# Altium schematic sheet Coffee_printer MCU.SchDoc
size 420 x 297 mm; SheetNumber: 1; SheetTotal: 5; ProjectTitle: Prj name
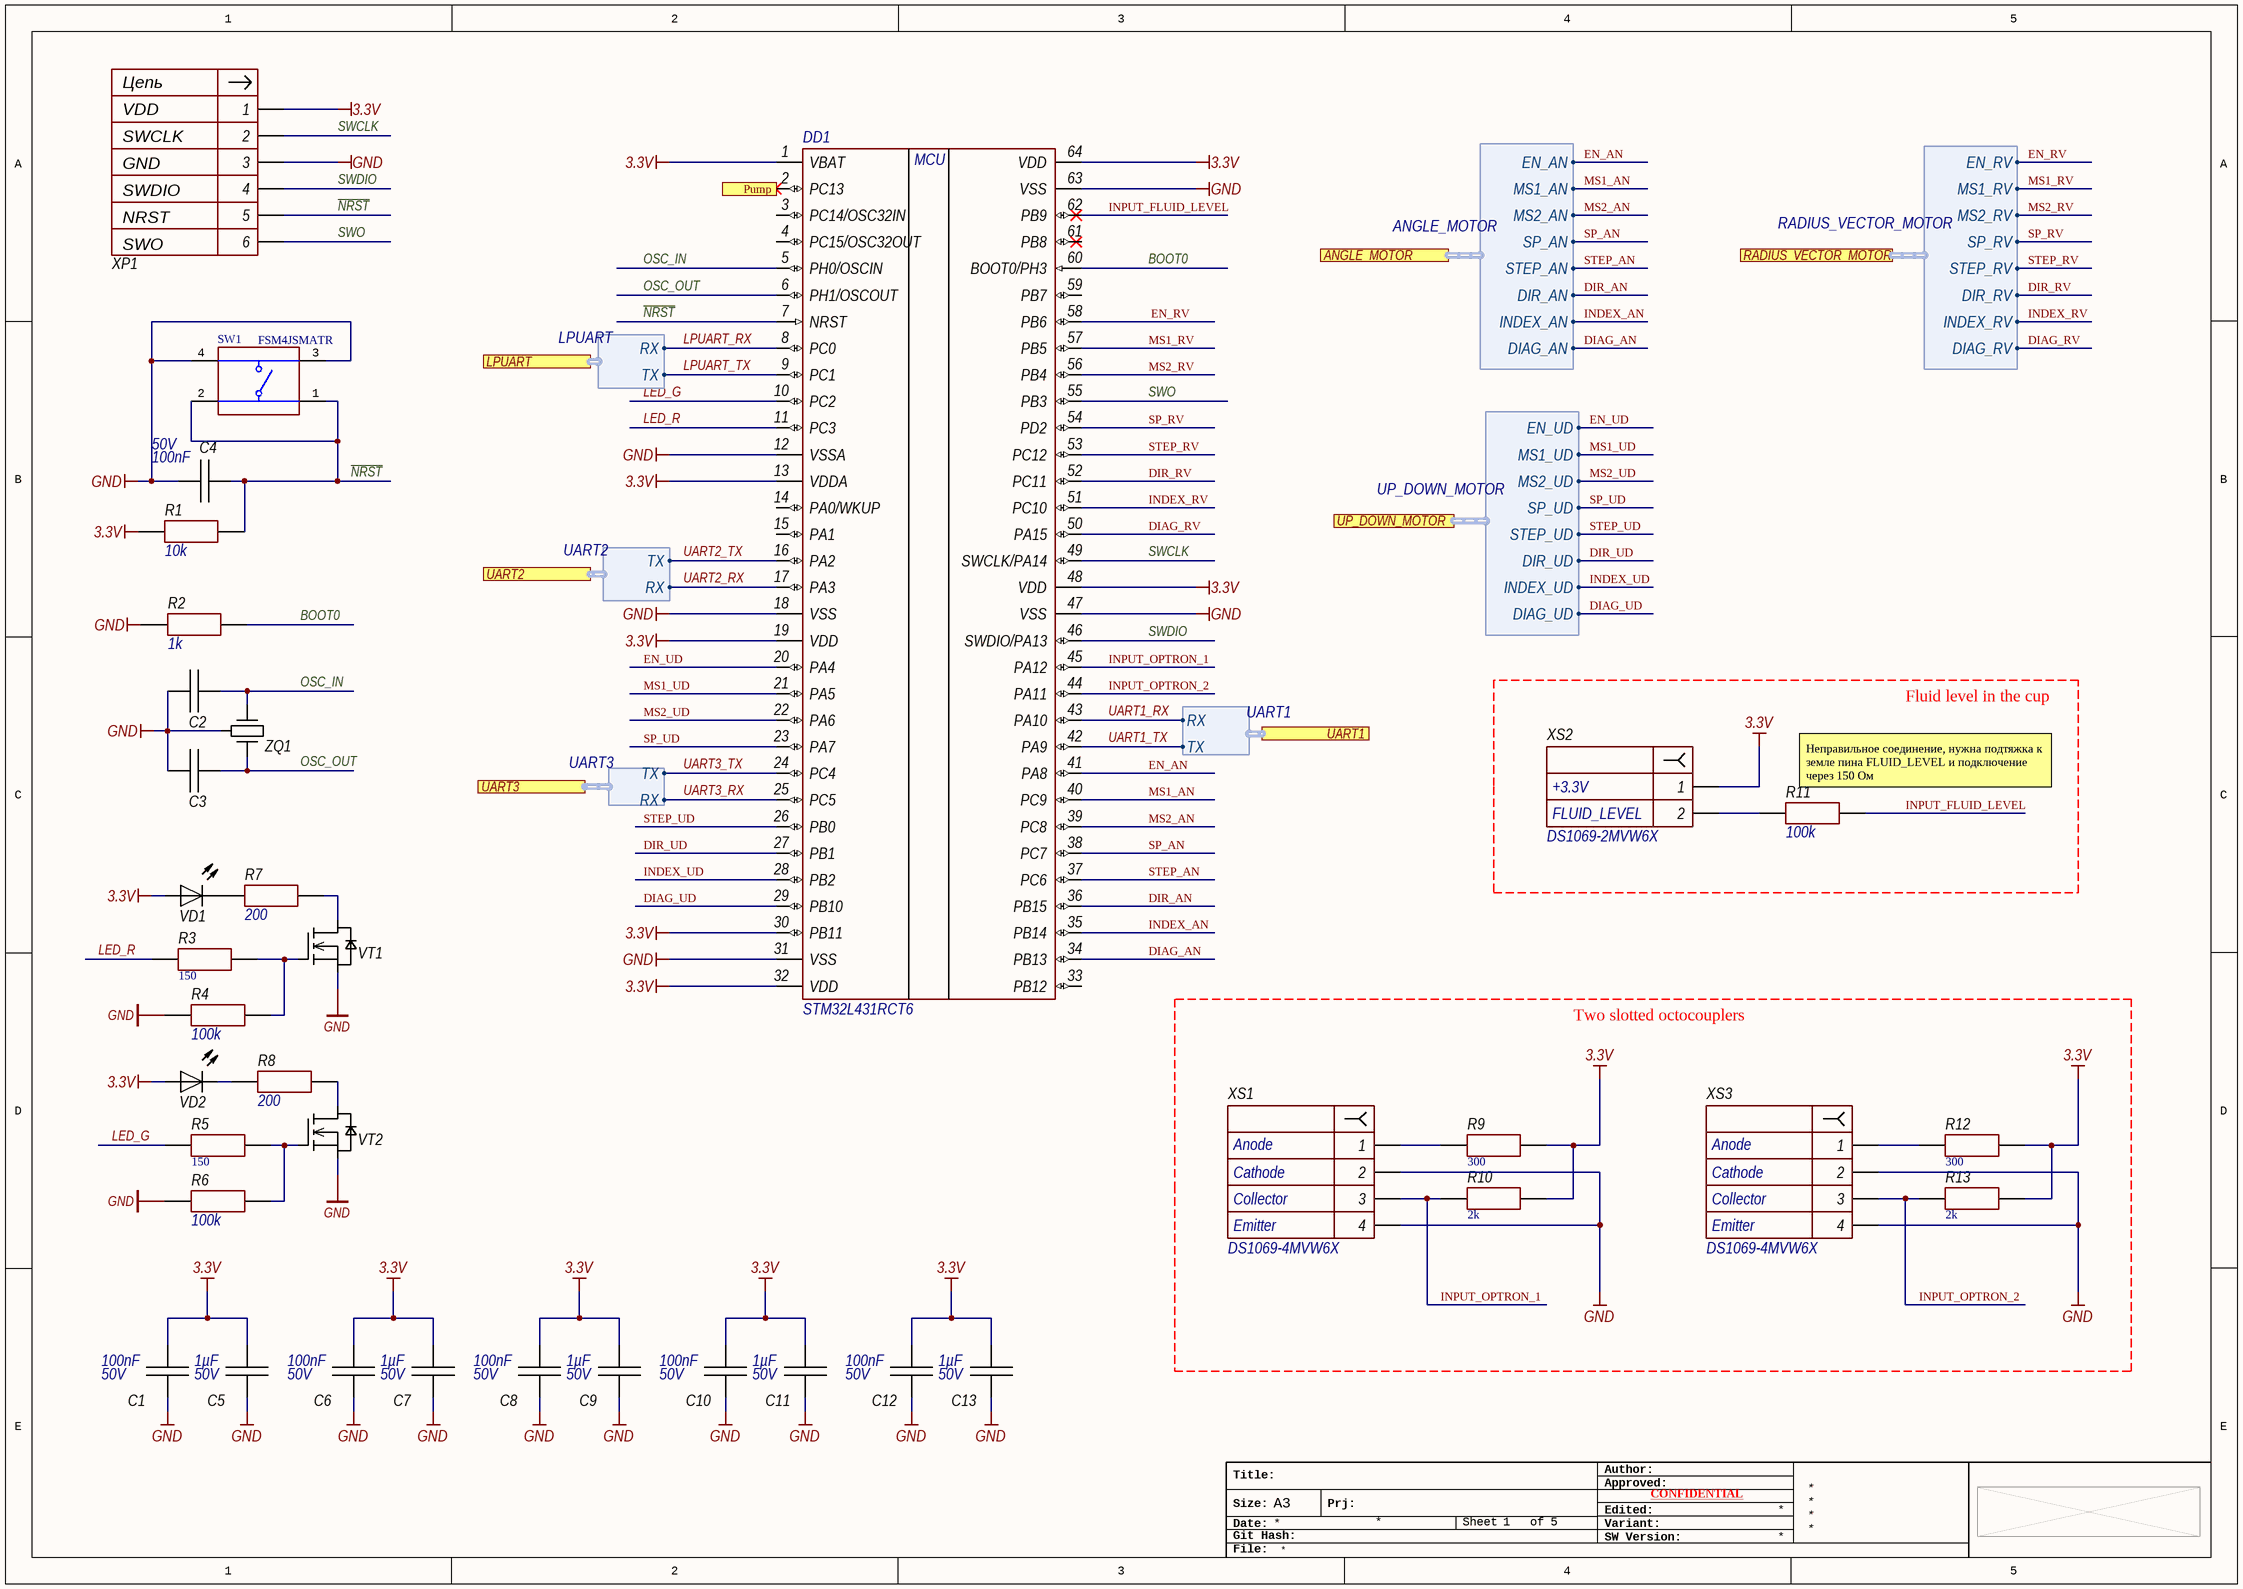
[diagram p0: Coffee_printer MCU.SchDoc]

## Parts
C1  Capacitance: 100nF  Voltage Rating: 50V  [CAPC0603_H0.90_N]  (hidden comment: CC0603KRX7R7BB104)
C2  18  [CAPC0603_H0.85_N]  (value not drawn)
C3  18  [CAPC0603_H0.85_N]  (value not drawn)
C4  Capacitance: 100nF  Voltage Rating: 50V  [CAPC0603_H0.90_N]  (hidden comment: CC0603KRX7R7BB104)
C5  Voltage Rating: 50V  Capacitance: 1µF  [CAPC0603_H0.90_N]  (hidden comment: CC0603KRX7R7BB105)
C6  Capacitance: 100nF  Voltage Rating: 50V  [CAPC0603_H0.90_N]  (hidden comment: CC0603KRX7R7BB104)
C7  Voltage Rating: 50V  Capacitance: 1µF  [CAPC0603_H0.90_N]  (hidden comment: CC0603KRX7R7BB105)
C8  Capacitance: 100nF  Voltage Rating: 50V  [CAPC0603_H0.90_N]  (hidden comment: CC0603KRX7R7BB104)
C9  Voltage Rating: 50V  Capacitance: 1µF  [CAPC0603_H0.90_N]  (hidden comment: CC0603KRX7R7BB105)
C10  Capacitance: 100nF  Voltage Rating: 50V  [CAPC0603_H0.90_N]  (hidden comment: CC0603KRX7R7BB104)
C11  Voltage Rating: 50V  Capacitance: 1µF  [CAPC0603_H0.90_N]  (hidden comment: CC0603KRX7R7BB105)
C12  Capacitance: 100nF  Voltage Rating: 50V  [CAPC0603_H0.90_N]  (hidden comment: CC0603KRX7R7BB104)
C13  Voltage Rating: 50V  Capacitance: 1µF  [CAPC0603_H0.90_N]  (hidden comment: CC0603KRX7R7BB105)
DD1  STM32L431RCT6  [LQFP-64]
R1  Resistance: 10k  [RESC0603_N]  (hidden comment: RC0603FR-0710KL)
R2  Resistance: 1k  [RESC0603_N]  (hidden comment: RC0603FR-071KL)
R3  Resistance: 150  [RESC0603_N]  (hidden comment: RC0603FR-07150RL)
R4  Resistance: 100k  [RESC0603_N]  (hidden comment: RC0603FR-07100KL)
R5  Resistance: 150  [RESC0603_N]  (hidden comment: RC0603FR-07150RL)
R6  Resistance: 100k  [RESC0603_N]  (hidden comment: RC0603FR-07100KL)
R7  Resistance: 200  [RESC0603_N]  (hidden comment: RC0603FR-07200RL)
R8  Resistance: 200  [RESC0603_N]  (hidden comment: RC0603FR-07200RL)
R9  Resistance: 300  [RESC0603_N]  (hidden comment: RC0603FR-07300RL)
R10  Resistance: 2k  [RESC0603_N]  (hidden comment: RC0603FR-072KL)
R11  Resistance: 100k  [RESC0603_N]  (hidden comment: RC0603FR-07100KL)
R12  Resistance: 300  [RESC0603_N]  (hidden comment: RC0603FR-07300RL)
R13  Resistance: 2k  [RESC0603_N]  (hidden comment: RC0603FR-072KL)
SW1  FSM4JSMATR  [TECO-FSM4JSMATR_V]
VD1  FYLS-0603URC  [CH0603LR]  (value not drawn)
VD2  FYLS-0603UGC  [CH0603LG]  (value not drawn)
VT1  MMBF170LT1G  [SOT-23-3]  (value not drawn)
VT2  MMBF170LT1G  [SOT-23-3]  (value not drawn)
XP1  STM32_6pin_SWD  [PLS-6(DS-1021-1x6)]  (value not drawn)
XS1  DS1069-4MVW6X  NET4: Emitter  NET3: Collector  NET2: Cathode  NET1: Anode  [CWF-4]
XS2  DS1069-2MVW6X  NET2: FLUID_LEVEL  NET1: +3.3V  [CWF-2]
XS3  DS1069-4MVW6X  NET4: Emitter  NET3: Collector  NET2: Cathode  NET1: Anode  [CWF-4]
ZQ1  ABM3B-8.000MHZ-B2-T  [ZQ_ABM3B-B2-T]  (value not drawn)

## Blocks framed on the sheet
Fluid level in the cup: R11 XS2
Two slotted octocouplers: R9 R10 R12 R13 XS1 XS3

## Ports
ANGLE_MOTOR (harness ANGLE_MOTOR), LPUART (harness LPUART), Pump (in), RADIUS_VECTOR_MOTOR (harness RADIUS_VECTOR_MOTOR), UART1 (harness UART1), UART2 (harness UART2), UART3 (harness UART3), UP_DOWN_MOTOR (harness UP_DOWN_MOTOR)

## Harnesses
UART2: RX, TX
UART1: RX, TX
UART3: RX, TX
LPUART: TX, RX
ANGLE_MOTOR: MS1_AN, EN_AN, MS2_AN, SP_AN, STEP_AN, DIR_AN, INDEX_AN, DIAG_AN
RADIUS_VECTOR_MOTOR: MS1_RV, EN_RV, MS2_RV, SP_RV, STEP_RV, DIR_RV, INDEX_RV, DIAG_RV
UP_DOWN_MOTOR: MS1_UD, EN_UD, MS2_UD, SP_UD, STEP_UD, DIR_UD, INDEX_UD, DIAG_UD

## Nets
3.3V: C1.1 C5.1 C6.1 C7.1 C8.1 C9.1 C10.1 C11.1 C12.1 C13.1 DD1.1(VBAT) DD1.13(VDDA) DD1.19(VDD) DD1.30(PB11) DD1.32(VDD) DD1.48(VDD) DD1.64(VDD) R1.1 R9.2 R10.2 R12.2 R13.2 VD1.1 VD2.1 XP1.1 XS2.1
GND: C1.2 C2.1 C3.1 C4.1 C5.2 C6.2 C7.2 C8.2 C9.2 C10.2 C11.2 C12.2 C13.2 DD1.12(VSSA) DD1.18(VSS) DD1.31(VSS) DD1.47(VSS) DD1.63(VSS) R2.1 R4.1 R6.2 SW1.3 SW1.4 VT1.2(S) VT2.2(S) XP1.3 XS1.2 XS1.4 XS3.2 XS3.4 ZQ1.2
BOOT0: DD1.60(BOOT0/PH3) R2.2
DIAG_AN: DD1.34(PB13) ; port ANGLE_MOTOR.DIAG_AN
DIAG_RV: DD1.50(PA15) ; port RADIUS_VECTOR_MOTOR.DIAG_RV
DIAG_UD: DD1.29(PB10) ; port UP_DOWN_MOTOR.DIAG_UD
DIR_AN: DD1.36(PB15) ; port ANGLE_MOTOR.DIR_AN
DIR_RV: DD1.52(PC11) ; port RADIUS_VECTOR_MOTOR.DIR_RV
DIR_UD: DD1.27(PB1) ; port UP_DOWN_MOTOR.DIR_UD
EN_AN: DD1.41(PA8) ; port ANGLE_MOTOR.EN_AN
EN_RV: DD1.58(PB6) ; port RADIUS_VECTOR_MOTOR.EN_RV
EN_UD: DD1.20(PA4) ; port UP_DOWN_MOTOR.EN_UD
INDEX_AN: DD1.35(PB14) ; port ANGLE_MOTOR.INDEX_AN
INDEX_RV: DD1.51(PC10) ; port RADIUS_VECTOR_MOTOR.INDEX_RV
INDEX_UD: DD1.28(PB2) ; port UP_DOWN_MOTOR.INDEX_UD
INPUT_FLUID_LEVEL: DD1.62(PB9) R11.1
INPUT_OPTRON_1: DD1.45(PA12) R10.1 XS1.3
INPUT_OPTRON_2: DD1.44(PA11) R13.1 XS3.3
LED_G: DD1.10(PC2) R5.1
LED_R: DD1.11(PC3) R3.1
LPUART_RX: DD1.8(PC0) ; port LPUART.RX
LPUART_TX: DD1.9(PC1) ; port LPUART.TX
MS1_AN: DD1.40(PC9) ; port ANGLE_MOTOR.MS1_AN
MS1_RV: DD1.57(PB5) ; port RADIUS_VECTOR_MOTOR.MS1_RV
MS1_UD: DD1.21(PA5) ; port UP_DOWN_MOTOR.MS1_UD
MS2_AN: DD1.39(PC8) ; port ANGLE_MOTOR.MS2_AN
MS2_RV: DD1.56(PB4) ; port RADIUS_VECTOR_MOTOR.MS2_RV
MS2_UD: DD1.22(PA6) ; port UP_DOWN_MOTOR.MS2_UD
~{NRST}: C4.2 DD1.7(NRST) R1.2 SW1.1 SW1.2 XP1.5
OSC_IN: C2.2 DD1.5(PH0/OSCIN) ZQ1.1
OSC_OUT: C3.2 DD1.6(PH1/OSCOUT) ZQ1.3
Pump: DD1.2(PC13) ; port Pump
SP_AN: DD1.38(PC7) ; port ANGLE_MOTOR.SP_AN
SP_RV: DD1.54(PD2) ; port RADIUS_VECTOR_MOTOR.SP_RV
SP_UD: DD1.23(PA7) ; port UP_DOWN_MOTOR.SP_UD
STEP_AN: DD1.37(PC6) ; port ANGLE_MOTOR.STEP_AN
STEP_RV: DD1.53(PC12) ; port RADIUS_VECTOR_MOTOR.STEP_RV
STEP_UD: DD1.26(PB0) ; port UP_DOWN_MOTOR.STEP_UD
SWCLK: DD1.49(SWCLK/PA14) XP1.2
SWDIO: DD1.46(SWDIO/PA13) XP1.4
SWO: DD1.55(PB3) XP1.6
UART1_RX: DD1.43(PA10) ; port UART1.RX
UART1_TX: DD1.42(PA9) ; port UART1.TX
UART2_RX: DD1.17(PA3) ; port UART2.RX
UART2_TX: DD1.16(PA2) ; port UART2.TX
UART3_RX: DD1.25(PC5) ; port UART3.RX
UART3_TX: DD1.24(PC4) ; port UART3.TX
NetR3_2: R3.2 R4.2 VT1.1(G)
NetR5_2: R5.2 R6.1 VT2.1(G)
NetR7_1: R7.1 VD1.2
NetR7_2: R7.2 VT1.3(D)
NetR8_1: R8.1 VD2.2
NetR8_2: R8.2 VT2.3(D)
NetR9_1: R9.1 XS1.1
NetR11_2: R11.2 XS2.2
NetR12_1: R12.1 XS3.1

Not connected (* = marked no-connect by the designer): DD1 3(PC14/OSC32IN) 4(PC15/OSC32OUT) 14(PA0/WKUP) 15(PA1) 33(PB12) 59(PB7) 61(PB8)

## Notes on the sheet
- (near R11) Неправильное соединение, нужна подтяжка к земле пина FLUID_LEVEL и подключение через 150 Ом
- Title:
- Author:
- Approved:
- Size:
- Date:
- Git Hash:
- A3
- Prj:
- Sheet
- of
- SW Version:
- Variant:
- Edited:
- CONFIDENTIAL
- File:
- (in symbol CMP-CON-B2B-0103-4) Цепь; VDD; SWCLK; GND; SWDIO; NRST; SWO
- (in symbol CMP-IC-EMBEDDED-MCU-0000-3) MCU

## Library data of the parts
C1 C4 C6 C8 C10 C12 = CMP-CAP-CER-SMD-0036-1: 0.1uF 10% X7R 50V 0603; Manufacturer: Yageo; Length: 1.6mm; Min Operating Temperature: -55°C; Case Code (Metric): 1608; Case Code (Imperial): 0603; Author: v.ivanchenko; Tolerance: 10%; Case/Package: 0603; Depth: 800µm; Manufacturer Part Number: CC0603KRX7R7BB104; HelpURL: https://www.yageo.com/upload/media/product/products/datasheet/mlcc/UPY-GPHC_X7R_6.3V-to-50V_20.pdf; Max Operating Temperature: 125°C; Lead Free: Lead Free; Height: 800µm; Dielectric: X7R; Series: CC
C2 C3 = CC0603FRNPO9BN180_Yageo: CAPC 18PF 50V C0G/NPO SMD 0603; Manufacturer: Yageo; Tolerance: ± 5 %; Voltage: 50 В; TKE: C0G; ValueBOM: Конденсатор CC0603FRNPO9BN180 "Yageo" (18 пФ ± 5 %, 50 В, C0G, SMD 0603); Автор: Жегалов Сергей; Количество1: 1; Цена1: 0.0348; Количество2: 4000; Цена2: 0.0268; Разрешен к применению: True; Type_BOM: Конденсатор; PartNumber: CC0603FRNPO9BN180_Yageo; HelpURL: http://www.yageo.com/documents/recent/UPY-GP_NP0_16V-to-50V_16.pdf; ManufacturerPartNumber: CC0603FRNPO9BN180; ComponentLink3Description: Datasheet; Value: 18; ComponentLink2Description: Manufacturer Link; ComponentLink2URL: http://www.yageo.com/; Operating Temperature: -55°C ~ +125°C; Modify: 15.11.2018 9:22:46; Supplier: Compel; Supplier P/N: CC0603FRNPO9BN180; Sorting: 18; Package Description: SMD 0603 H0.85mm; ComponentLink4URL: https://sds.compel.ru/search?q=CC0603FRNPO9BN180; ComponentLink5URL: https://www.chipdip.by/search?searchtext=CC0603FRNPO9BN180; ComponentLink6URL: https://belchip.by/search_fuzzy/?query=CC0603FRNPO9BN180; ComponentLink4Description: Compel; ComponentLink5Description: Chip-Dip; ComponentLink6Description: Belchip; Package: CAPC0603; Package_BOM: SMD 0603
C5 C7 C9 C11 C13 = CMP-CAP-CER-SMD-0035-1: 1uF 10% X7R 50V 0603; Manufacturer: Yageo; HelpURL: https://www.yageo.com/upload/media/product/products/datasheet/mlcc/UPY-GPHC_X7R_6.3V-to-50V_20.pdf; Series: CC; Min Operating Temperature: -55°C; Tolerance: 10%; Case Code (Imperial): 0603; Manufacturer Part Number: CC0603KRX7R7BB105; Max Operating Temperature: 125°C; Case/Package: 0603; Depth: 800µm; Length: 1.6mm; Height: 800µm; Case Code (Metric): 1608; Lead Free: Lead Free; Dielectric: X7R; Author: v.ivanchenko
DD1 = CMP-IC-EMBEDDED-MCU-0000-3: MCU 32-Bit STM32 ARM Cortex M4 RISC 256KB Flash 1.8V/2.5V/3.3V 64-Pin LQFP; Manufacturer: ST; Core Architecture: ARM Cortex-M4; Number of Timers/Counters: 1; Number of ADC Channels: 16; Number of D/A Converters: 2; RAM Size: 64; Frequency: 80MHz; Min Supply Voltage: 1.62V; Number of UART Channels: 4; Interface: CAN, I2C, IrDA, LIN, SPI, USART; Max Supply Voltage: 3.6V; Number of USART Channels: 3; Number of PWM Channels: 11; Number of I/Os: 52; Manufacturer Part Number: STM32L431RCT6; Author: a.antipov; Case/Package: LQFP-64; Min Operating Temperature: -40°C; Number of A/D Converters: 1; Number of Pins: 64; Mount: Surface mount; Max Operating Temperature: 85°C; HelpUrl: https://www.st.com/resource/en/datasheet/stm32l431rc.pdf; Number of I2C Channels: 3; Number of SPI Channels: 3; Flash Memory Size: 256kB
R1 = CMP-RES-SMD-0437-2: RES SMD 10 KOHM 1% 1/10W 0603; Manufacturer: Yageo; Max Power Dissipation: 100mW; Temperature Coefficient: ±100ppm/C°; Voltage Rating: 75V; Author: M.S. Koval; Case/Package: 0603; HelpURL: https://www.yageo.com/upload/media/product/productsearch/datasheet/rchip/PYu-RC_Group_51_RoHS_L_11.pdf; Manufacturer Part Number: RC0603FR-0710KL; Max Operating Temperature: 155°C; Min Operating Temperature: -55°C; Tolerance: 1%
R2 = CMP-RES-SMD-0413-2: RES SMD 1 KOHM 1% 1/10W 0603; Manufacturer: Yageo; Max Power Dissipation: 100mW; Temperature Coefficient: ±100ppm/C°; Voltage Rating: 75V; Author: M.S. Koval; Case/Package: 0603; HelpURL: https://www.yageo.com/upload/media/product/productsearch/datasheet/rchip/PYu-RC_Group_51_RoHS_L_11.pdf; Manufacturer Part Number: RC0603FR-071KL; Max Operating Temperature: 155°C; Min Operating Temperature: -55°C; Tolerance: 1%
R3 R5 = CMP-RES-SMD-0393-5: RES SMD 150 OHM 1% 1/10W 0603; Manufacturer: Yageo; Max Power Dissipation: 100mW; Temperature Coefficient: ±100ppm/C°; Voltage Rating: 75V; Author: M.S. Koval; Case/Package: 0603; HelpURL: https://www.yageo.com/upload/media/product/productsearch/datasheet/rchip/PYu-RC_Group_51_RoHS_L_11.pdf; Manufacturer Part Number: RC0603FR-07150RL; Max Operating Temperature: 155°C; Min Operating Temperature: -55°C; Tolerance: 1%
R4 R6 R11 = CMP-RES-SMD-0462-2: RES SMD 100 KOHM 1% 1/10W 0603; Manufacturer: Yageo; Max Power Dissipation: 100mW; Temperature Coefficient: ±100ppm/C°; Voltage Rating: 75V; Author: M.S. Koval; Case/Package: 0603; HelpURL: https://www.yageo.com/upload/media/product/productsearch/datasheet/rchip/PYu-RC_Group_51_RoHS_L_11.pdf; Manufacturer Part Number: RC0603FR-07100KL; Max Operating Temperature: 155°C; Min Operating Temperature: -55°C; Tolerance: 1%
R7 R8 = CMP-RES-SMD-0396-2: RES SMD 200 OHM 1% 1/10W 0603; Manufacturer: Yageo; Max Power Dissipation: 100mW; Temperature Coefficient: ±100ppm/C°; Voltage Rating: 75V; Author: M.S. Koval; Case/Package: 0603; HelpURL: https://www.yageo.com/upload/media/product/productsearch/datasheet/rchip/PYu-RC_Group_51_RoHS_L_11.pdf; Manufacturer Part Number: RC0603FR-07200RL; Max Operating Temperature: 155°C; Min Operating Temperature: -55°C; Tolerance: 1%
R9 R12 = CMP-RES-SMD-0400-5: RES SMD 300 OHM 1% 1/10W 0603; Manufacturer: Yageo; Voltage Rating: 75V; Temperature Coefficient: ±100ppm/C°; Max Power Dissipation: 100mW; Max Operating Temperature: 155°C; Tolerance: 1%; HelpURL: https://www.yageo.com/upload/media/product/productsearch/datasheet/rchip/PYu-RC_Group_51_RoHS_L_11.pdf; Min Operating Temperature: -55°C; Case/Package: 0603; Author: M.S. Koval; Manufacturer Part Number: RC0603FR-07300RL
R10 R13 = CMP-RES-SMD-0420-5: RES SMD 2 KOHM 1% 1/10W 0603; Manufacturer: Yageo; Max Power Dissipation: 100mW; Temperature Coefficient: ±100ppm/C°; Voltage Rating: 75V; Author: M.S. Koval; Case/Package: 0603; HelpURL: https://www.yageo.com/upload/media/product/productsearch/datasheet/rchip/PYu-RC_Group_51_RoHS_L_11.pdf; Manufacturer Part Number: RC0603FR-072KL; Max Operating Temperature: 155°C; Min Operating Temperature: -55°C; Tolerance: 1%
SW1 = CMP-2000-07486-1: Micro Miniature Push Button Switch FSM JSM, 50 mA, -35 to 85 degC, 4-Pin SMD, RoHS, Tape and Reel; Manufacturer: TE Connectivity; Mechanical Life: 100000Cycles; Current Rating: 50mA; Actuator Material: Polyamide; Max Voltage Rating (DC): 12V; Capacitance: 0f; Illumination Type: Illuminated; Voltage Rating (DC): 24V; Case\/Package: SMD/SMT; Operating Force: 160gf; Contact Resistance: 100mOhm; Actuator Length: 0.055inch; Switch Travel: 0.25mm; Throw Configuration: SPST; Termination: GullWing; Contact Plating: Silver; Orientation: Straight; Mounting Technology: SurfaceMount; REACH SVHC: Unknown; Electrical Life: 100000Cycles; Package Reference: FSM4JSMATR; Max Operating Temperature: 85degC; Manufacturer URL: http://www.te.com/; Package Description: 4-Pin Surface Mount Device, Body 6 x 6 mm, Pitch 4.5 mm; Datasheet Version: Rev. V, 02/2015; Packaging: TapeandReel; Min Operating Temperature: -35degC; Mount: SurfaceMount; Contact Current Rating: 50mA; Contact Material: CopperAlloy; Package Quantity: 1200; Datasheet URL: http://www.te.com/commerce/DocumentDelivery/DDEController?Action=showdoc&DocId=Customer+Drawing%7F2-1437565-7%7FV%7Fpdf%7FEnglish%7FENG_CD_2-1437565-7_V.pdf%7F4-1437565-2; RoHSCompliant: true
VD1 = FYLS-0603URC_Foryard Optoelectronics: VD FYLS-0603URC LED RED 20mA 2,1V SMD 0603; ValueBOM: Диод FYLS-0603URC "Foryard Optoelectronics" CH0603; Voltage: 2,1 В; Автор: Коваль Максим; Количество1: 1; Цена1: 0.0450; Количество2: 16000; Цена2: 0.0306; Разрешен к применению: True; ВП: Диод FYLS-0603URC CH0603; Package_BOM: CH0603; Type_BOM: Диод; PartNumber: FYLS-0603URC_Foryard Optoelectronics; HelpURL: http://www.foryard-led.ru/pdf/fyls-0603urc.pdf; ManufacturerPartNumber: FYLS-0603URC; Manufacturer: Foryard Optoelectronics; ComponentLink3Description: Datasheet; Value: FYLS-0603URC; ComponentLink2Description: Manufacturer Link; ComponentLink2URL: http://foryard.com; Operating Temperature: -40°C ~ +85°C; Modify: 14.01.2019 13:57:40; Supplier: Compel; Supplier P/N: FYLS-0603URC; Package Description: LED 0603 RED; ComponentLink4URL: https://sds.compel.ru/search?q=FYLS-0603URC; ComponentLink5URL: https://www.chipdip.by/search?searchtext=FYLS-0603URC; ComponentLink6URL: https://belchip.by/search_fuzzy/?query=FYLS-0603URC; ComponentLink4Description: Compel; ComponentLink5Description: Chip-Dip; ComponentLink6Description: Belchip
VD2 = FYLS-0603UGC_Foryard Optoelectronics: VD FYLS-0603UGC LED GREEN 20mA 2V SMD 0603; ValueBOM: Диод FYLS-0603UGC "Foryard Optoelectronics" CH0603; Voltage: 2 В; Автор: Коваль Максим; Количество1: 1; Цена1: 0.0450; Количество2: 16000; Цена2: 0.0306; Разрешен к применению: True; ВП: Диод FYLS-0603UGC CH0603; Package_BOM: CH0603; Type_BOM: Диод; PartNumber: FYLS-0603UGC_Foryard Optoelectronics; HelpURL: http://www.foryard-led.ru/pdf/fyls-0603ugc.pdf; ManufacturerPartNumber: FYLS-0603UGC; Manufacturer: Foryard Optoelectronics; ComponentLink3Description: Datasheet; Value: FYLS-0603UGC; ComponentLink2Description: Manufacturer Link; ComponentLink2URL: http://foryard.com; Operating Temperature: -40°C ~ +85°C; Modify: 14.01.2019 13:57:40; Supplier: Compel; Supplier P/N: FYLS-0603UGC; Package Description: LED 0603 GREEN; ComponentLink4URL: https://sds.compel.ru/search?q=FYLS-0603UGC; ComponentLink5URL: https://www.chipdip.by/search?searchtext=FYLS-0603UGC; ComponentLink6URL: https://belchip.by/search_fuzzy/?query=FYLS-0603UGC; ComponentLink4Description: Compel; ComponentLink5Description: Chip-Dip; ComponentLink6Description: Belchip
VT1 VT2 = CMP-DISCRETE-TRANSISTORS-MOSFET0002-1: MMBF170L: Small Signal MOSFET 60V 500mA 5 Ohm Single N-Channel SOT-23 Logic Level; Manufacturer: ON Semiconductor; Type: N-ch; Power Dissipation: 225mW; Input Capacitance: 60pF; Theshold Voltage Vgth: 3V; Rds ON Max: 5; Gate to source voltage: 20V; Drain to Source Voltage Vds: 60V; Mount: Surface mount; Manufacturer Part Number: MMBF170LT1G; HelpUrl: https://www.onsemi.com/pdf/datasheet/mmbf170lt1-d.pdf; Continuous Drain Current ID: 500mA; Author: m.seliadtsou
XP1 = CMP-CON-B2B-0103-4: Manufacturer: FOXCONN; Manufacturer Part Number: HB3106F; Contact Current Rating: 2A; Gender: Male; Number of Contacts: 6; Pitch: 2.54mm; Voltage Rating: 60V; Author: v.taranau; Contact Gender: Male Headers; HelpURL: https://datasheet.lcsc.com/lcsc/2103291806_FOXCONN-HB3106F_C2761399.pdf; Mount: Through Hole
XS1 XS3 = CMP-CON-B2B-0011-2: 2.5mm, 4 pin, Male, 3A, Vertical mounting, CONNFLY; Gender: Female; Number of Contacts: 4; Voltage Rating: 250V; Author: a.antipov; Color: White; Contact Current Rating: 3A; Contact Gender: Male; Contact Plating: Tin; HelpURL: http://outer.connfly.group/static/upload/file/pdf/DS1069.pdf; Manufacturer: CONNFLY; Manufacturer Part Number: DS1069-4MVW6X; Mount: Through Hole; Orientation: Vertical; Pitch: 2.5mm
XS2 = CMP-CON-B2B-0007-3: 2.5mm, 2 pin, Male, 3A, Vertical mounting, CONNFLY; Gender: Female; Number of Contacts: 2; Voltage Rating: 250V; Author: a.antipov; Color: White; Contact Current Rating: 3A; Contact Gender: Male; Contact Plating: Tin; HelpURL: http://outer.connfly.group/static/upload/file/pdf/DS1069.pdf; Manufacturer: CONNFLY; Manufacturer Part Number: DS1069-2MVW6X; Mount: Through Hole; Orientation: Vertical; Pitch: 2.5mm
ZQ1 = ABM3B-8.000MHZ-B2-T_Abracon LLC: ZQ ABM3B-8.000MHZ-B2-T CERAMIC SMD CRYSTAL 8 MHz; ValueBOM: Кварцевый резонатор ABM3B-8.000MHZ-B2-T "Abracon LLC"; Автор: Касперович Андрей; Количество1: 1; Цена1: 0.4; Количество2: 10000; Цена2: 0.266; Разрешен к применению: True; ВП: Кварцевый резонатор ABM3B-8.000MHZ-B2-T; Type_BOM: Разное; HelpURL: https://ru.mouser.com/datasheet/2/3/abm3b-39910.pdf; PartNumber: ABM3B-8.000MHZ-B2-T_Abracon LLC; ManufacturerPartNumber: ABM3B-8.000MHZ-B2-T; Manufacturer: Abracon LLC; Value: ABM3B-8.000MHZ-B2-T; ComponentLink3Description: Datasheet; Modify: 16.11.2018 10:44:09; Supplier: Compel; Supplier P/N: ABM3B-8.000MHZ-B2-T; Package: ZQ_ABM3B-B2-T; ComponentLink4URL: https://sds.compel.ru/search?q=ABM3B-8.000MHZ-B2-T; ComponentLink5URL: https://www.chipdip.by/search?searchtext=ABM3B-8.000MHZ-B2-T; ComponentLink6URL: https://belchip.by/search_fuzzy/?query=ABM3B-8.000MHZ-B2-T; ComponentLink4Description: Compel; ComponentLink5Description: Chip-Dip; ComponentLink6Description: Belchip; Package_BOM: ZQ_ABM3B-B2-T; Package Description: ZQ_ABM3B-B2-T; SMD mounting: True; ComponentLink1Description: Supplier; ComponentLink1URL: http://www.compel.ru; ComponentLink2Description: Manufacturer Link; ComponentLink2URL: http://www.abracon.com; Type: XXX